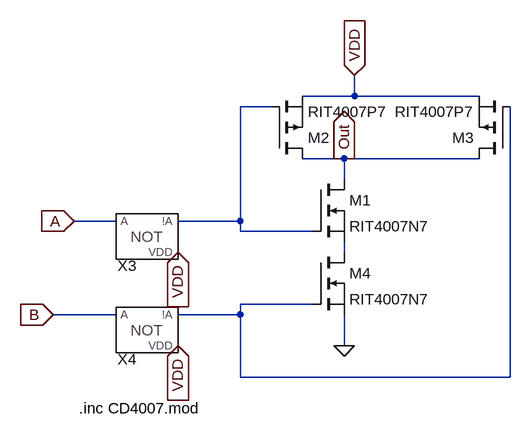
[diagram p0: schematic Gate_OR.asc]
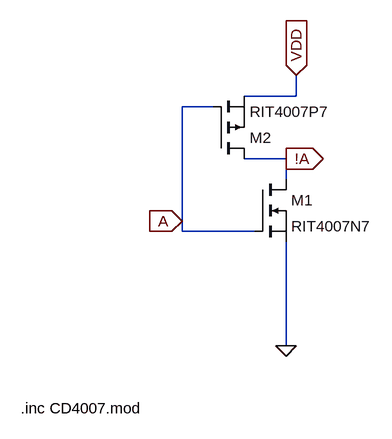
[diagram p1: sub-circuit gate_not.asc]
Gate_OR.asc, the LTspice schematic file:
Version 4
SHEET 1 880 680
WIRE 64 -112 64 -144
WIRE 64 -112 -16 -112
WIRE 256 -112 64 -112
WIRE -64 -96 -112 -96
WIRE 48 -16 -16 -16
WIRE 256 -16 48 -16
WIRE 48 16 48 -16
WIRE -304 80 -368 80
WIRE -112 80 -112 -96
WIRE -112 80 -208 80
WIRE -112 96 -112 80
WIRE 0 96 -112 96
WIRE 48 128 48 112
WIRE 0 208 -112 208
WIRE -304 224 -400 224
WIRE -112 224 -112 208
WIRE -112 224 -208 224
WIRE 48 272 48 224
WIRE -112 320 -112 224
WIRE 304 320 304 -96
WIRE 304 320 -112 320
FLAG 48 272 0
FLAG -368 80 A
IOPIN -368 80 In
FLAG -400 224 B
IOPIN -400 224 In
FLAG 48 -16 Out
IOPIN 48 -16 Out
FLAG 64 -144 VDD
IOPIN 64 -144 In
FLAG -208 128 VDD
IOPIN -208 128 In
FLAG -208 272 VDD
IOPIN -208 272 In
SYMBOL nmos 0 16 R0
SYMATTR InstName M1
SYMATTR Value RIT4007N7
SYMBOL pmos -64 -16 M180
SYMATTR InstName M2
SYMATTR Value RIT4007P7
SYMBOL pmos 304 -16 R180
SYMATTR InstName M3
SYMATTR Value RIT4007P7
SYMBOL nmos 0 128 R0
SYMATTR InstName M4
SYMATTR Value RIT4007N7
SYMBOL Gate_NOT -256 112 R0
SYMATTR InstName X3
SYMBOL Gate_NOT -256 256 R0
SYMATTR InstName X4
TEXT -360 368 Left 2 !.inc CD4007.mod

gate_not.asc, the sub-circuit schematic file:
Version 4
SHEET 1 880 680
WIRE 64 -112 64 -144
WIRE 64 -112 -16 -112
WIRE -64 -96 -112 -96
WIRE 48 -16 -16 -16
WIRE 48 16 48 -16
WIRE -112 80 -112 -96
WIRE -112 96 -112 80
WIRE 0 96 -112 96
WIRE 48 272 48 112
FLAG 48 272 0
FLAG -112 80 A
IOPIN -112 80 In
FLAG 48 -16 !A
IOPIN 48 -16 Out
FLAG 64 -144 VDD
IOPIN 64 -144 In
SYMBOL nmos 0 16 R0
SYMATTR InstName M1
SYMATTR Value RIT4007N7
SYMBOL pmos -64 -16 M180
SYMATTR InstName M2
SYMATTR Value RIT4007P7
TEXT -360 368 Left 2 !.inc CD4007.mod

The netlist it stands for:
* Gate_OR.asc
M1 Out N001 N002 N002 RIT4007N7
M2 Out N001 VDD VDD RIT4007P7
M3 Out N003 VDD VDD RIT4007P7
M4 N002 N003 0 0 RIT4007N7
XX3 A VDD N001 gate_not
XX4 B VDD N003 gate_not

* block symbol definitions
.subckt gate_not A VDD !A
M1 !A A 0 0 RIT4007N7
M2 !A A VDD VDD RIT4007P7
.inc CD4007.mod
.ends gate_not

.model NMOS NMOS
.model PMOS PMOS
.lib standard.mos
.inc CD4007.mod
.backanno
.end